# EasyEDA Pro project ProPrj_功率计集成分电板_2025-12-12.epro

# Schematic Schematic1
Board Name: Board1; Create Date: 2025-11-25; Page Name: P1; Project Name: 功率计集成分电板; Schematic Name: Schematic1; Update Date: 2025-12-05; Company: 嘉立创EDA; Page Size: A4; Version: V1.0
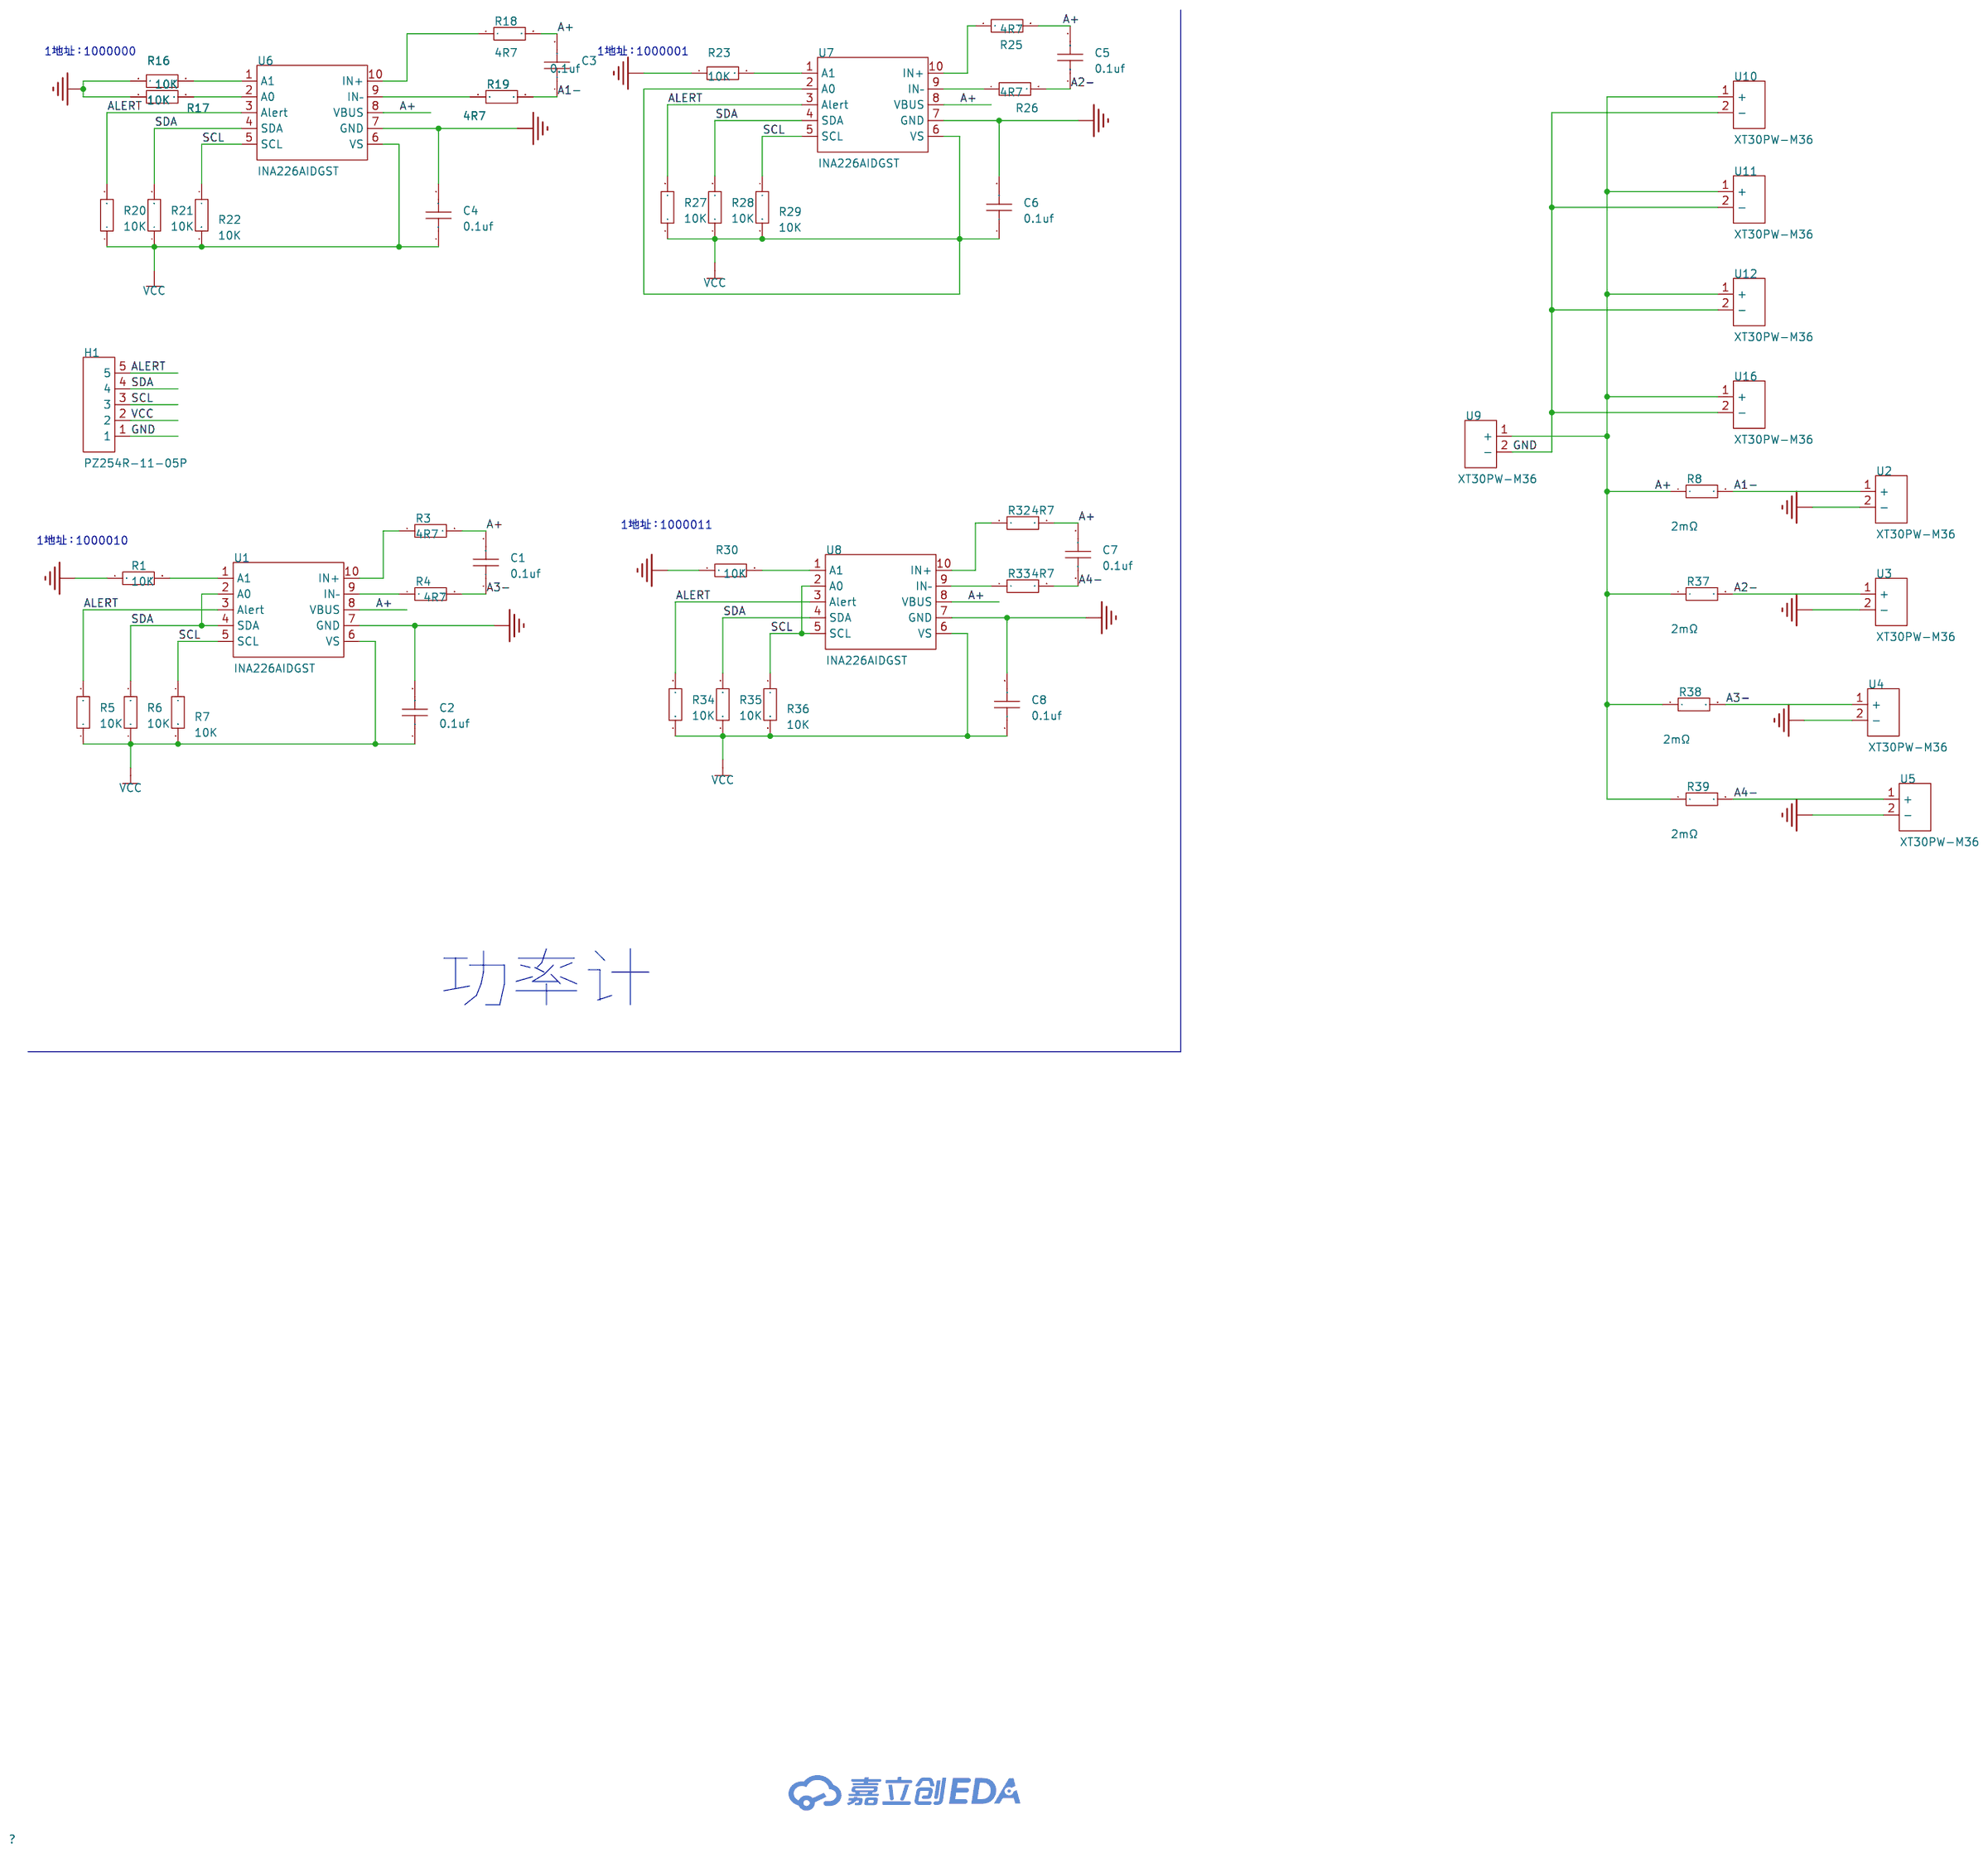
[diagram p0: schematic sheet]

## Parts
C1  0.1uf  [C0603]
C2  0.1uf  [C0603]
C3  0.1uf  [C0603]
C4  0.1uf  [C0603]
C5  0.1uf  [C0603]
C6  0.1uf  [C0603]
C7  0.1uf  [C0603]
C8  0.1uf  [C0603]
H1  PZ254R-11-05P  [HDR-TH_5P-P2.54-H-M-W10.4]
R1  10K  [R0603]
R3  4R7  [R0603]
R4  4R7  [R0603]
R5  10K  [R0603]
R6  10K  [R0603]
R7  10K  [R0603]
R8  2mΩ  [R0603]
R16  10K  [R0603]
R17  10K  [R0603]
R18  4R7  [R0603]
R19  4R7  [R0603]
R20  10K  [R0603]
R21  10K  [R0603]
R22  10K  [R0603]
R23  10K  [R0603]
R25  4R7  [R0603]
R26  4R7  [R0603]
R27  10K  [R0603]
R28  10K  [R0603]
R29  10K  [R0603]
R30  10K  [R0603]
R32  4R7  [R0603]
R33  4R7  [R0603]
R34  10K  [R0603]
R35  10K  [R0603]
R36  10K  [R0603]
R37  2mΩ  [R0603]
R38  2mΩ  [R0603]
R39  2mΩ  [R0603]
U1  INA226AIDGST  [VSSOP-10_L3.0-W3.0-P0.50-LS4.9-BL]
U2  XT30PW-M36  [CONN-TH_2P-P5.00_XT30PW-M36]
U3  XT30PW-M36  [CONN-TH_2P-P5.00_XT30PW-M36]
U4  XT30PW-M36  [CONN-TH_2P-P5.00_XT30PW-M36]
U5  XT30PW-M36  [CONN-TH_2P-P5.00_XT30PW-M36]
U6  INA226AIDGST  [VSSOP-10_L3.0-W3.0-P0.50-LS4.9-BL]
U7  INA226AIDGST  [VSSOP-10_L3.0-W3.0-P0.50-LS4.9-BL]
U8  INA226AIDGST  [VSSOP-10_L3.0-W3.0-P0.50-LS4.9-BL]
U9  XT30PW-M36  [CONN-TH_2P-P5.00_XT30PW-M36]
U10  XT30PW-M36  [CONN-TH_2P-P5.00_XT30PW-M36]
U11  XT30PW-M36  [CONN-TH_2P-P5.00_XT30PW-M36]
U12  XT30PW-M36  [CONN-TH_2P-P5.00_XT30PW-M36]
U16  XT30PW-M36  [CONN-TH_2P-P5.00_XT30PW-M36]

## Library data of the parts
C1-C8 = CAP_0603: Supplier Footprint: 0603
H1 = PZ254R-11-05P: 插针结构:1x5P;间距:2.54mm;行距:-;圆针/方针:方针;安装方式:弯插;排数:单排;总PIN位数:5P;额定电流:-;额定电压:-;配合针长度:6mm;塑高:2.5mm;触头材质:黄铜;触头镀层:-;工作温度:-40℃~+105℃;颜色:黑色;; LCSC Part Name: 1x5P 间距:2.54mm 方针 弯插; Supplier Part: C492413; Manufacturer: XFCN(兴飞); Supplier Footprint: 弯插,P=2.54mm; JLCPCB Part Class: 扩展库; Datasheet: https://atta.szlcsc.com/upload/public/pdf/source/20200309/C492413_82088D06BDD816AEC12FB986624DD327.pdf; Supplier: LCSC; Pin Structure: 1x5P; Pitch: 2.54mm; Circluar Pins/Square Pins: 方针; Mounting Type: 弯插; Number of Rows: 单排; Number of Pins: 5P; Length of Mating Pin: 6mm; Insulation Height: 2.5mm; Contact Material: 黄铜; Operating Temperature: -40℃~+105℃; Color: 黑色
R1 R3-R7 R16-R23 R25-R30 R32-R36 = Res_0603: Supplier Footprint: 0603
R8 R37-R39 = WFCP06032L000FE66: 电阻类型:-;阻值:2mΩ;精度:±1%;功率:500mW;温度系数:±100ppm/℃;; LCSC Part Name: 2mΩ ±1% 500mW; Supplier Part: C4077045; Manufacturer: VISHAY(威世); Supplier Footprint: 0603; JLCPCB Part Class: Extended Part; Datasheet: https://atta.szlcsc.com/upload/public/pdf/source/20231212/95FD194A86FE0177FC1AB75510CE32D6.pdf; Supplier: LCSC; Tolerance: ±1%; Power(Watts): 500mW; Temperature Coefficient: ±100ppm/℃; Operating Temperature Range: -55℃~+170℃
U1 U6-U8 = INA226AIDGST: 共模电压:36V;; LCSC Part Name: 高侧/低侧双向电流/功率监视器; Supplier Part: C2653870; Manufacturer: TI(德州仪器); Supplier Footprint: VSSOP-10-0.5mm; JLCPCB Part Class: 扩展库; Datasheet: https://www.ti.com/cn/lit/gpn/ina226; Supplier: LCSC; Vcm - Common Mode Voltage: 36V; Operating Temperature: -40℃~+125℃
U2-U5 U9-U12 U16 = XT30PW-M36: Supplier Part: C9900222726; Supplier Footprint: XT30; Supplier: LCSC

## Nets
GND: C2.2 C4.2 C6.2 C8.2 H1.1 R1.1 R16.1 R17.1 R23.1 R30.1 U1.7(GND) U2.2(-) U3.2(-) U4.2(-) U5.2(-) U6.7(GND) U7.7(GND) U8.7(GND) U9.2(-) U10.2(-) U11.2(-) U12.2(-) U16.2(-)
VCC: C2.1 C4.1 C6.1 C8.1 H1.2 R5.1 R6.1 R7.2 R20.1 R21.1 R22.2 R27.1 R28.1 R29.2 R34.1 R35.1 R36.2 U1.6(VS) U6.6(VS) U7.2(A0) U7.6(VS) U8.6(VS)
A1-: C3.1 R8.2 R19.2 U2.1(+)
A2-: C5.1 R26.2 R37.2 U3.1(+)
A3-: C1.1 R4.2 R38.2 U4.1(+)
A4-: C7.1 R33.2 R39.2 U5.1(+)
A+: C1.2 C3.2 C5.2 C7.2 R3.2 R8.1 R18.2 R25.2 R32.2 R37.1 R38.1 R39.1 U1.8(VBUS) U6.8(VBUS) U7.8(VBUS) U8.8(VBUS) U9.1(+) U10.1(+) U11.1(+) U12.1(+) U16.1(+)
ALERT: H1.5 R5.2 R20.2 R27.2 R34.2 U1.3(Alert) U6.3(Alert) U7.3(Alert) U8.3(Alert)
SCL: H1.3 R7.1 R22.1 R29.1 R36.1 U1.5(SCL) U6.5(SCL) U7.5(SCL) U8.2(A0) U8.5(SCL)
SDA: H1.4 R6.2 R21.2 R28.2 R35.2 U1.2(A0) U1.4(SDA) U6.4(SDA) U7.4(SDA) U8.4(SDA)
$1N353: R4.1 U1.9(IN–)
$1N378: R3.1 U1.10(IN+)
$1N388: R1.2 U1.1(A1)
$1N1566: R16.2 U6.1(A1)
$1N1568: R17.2 U6.2(A0)
$1N1909: R26.1 U7.9(IN–)
$1N1914: R25.1 U7.10(IN+)
$1N1921: R23.2 U7.1(A1)
$1N2264: R33.1 U8.9(IN–)
$1N2269: R32.1 U8.10(IN+)
$1N2276: R30.2 U8.1(A1)
$1N4532: R19.1 U6.9(IN–)
$1N4545: R18.1 U6.10(IN+)

## Notes on the sheet
- 1地址：1000000
- 1地址：1000001
- 1地址：1000011
- 1地址：1000010
- 功率计

# Schematic Schematic2
Board Name: Board2; Create Date: 2025-12-06; Page Name: P1; Project Name: 功率计集成分电板; Schematic Name: Schematic2; Update Date: 2025-12-08; Company: 嘉立创EDA; Page Size: A4; Version: V1.0
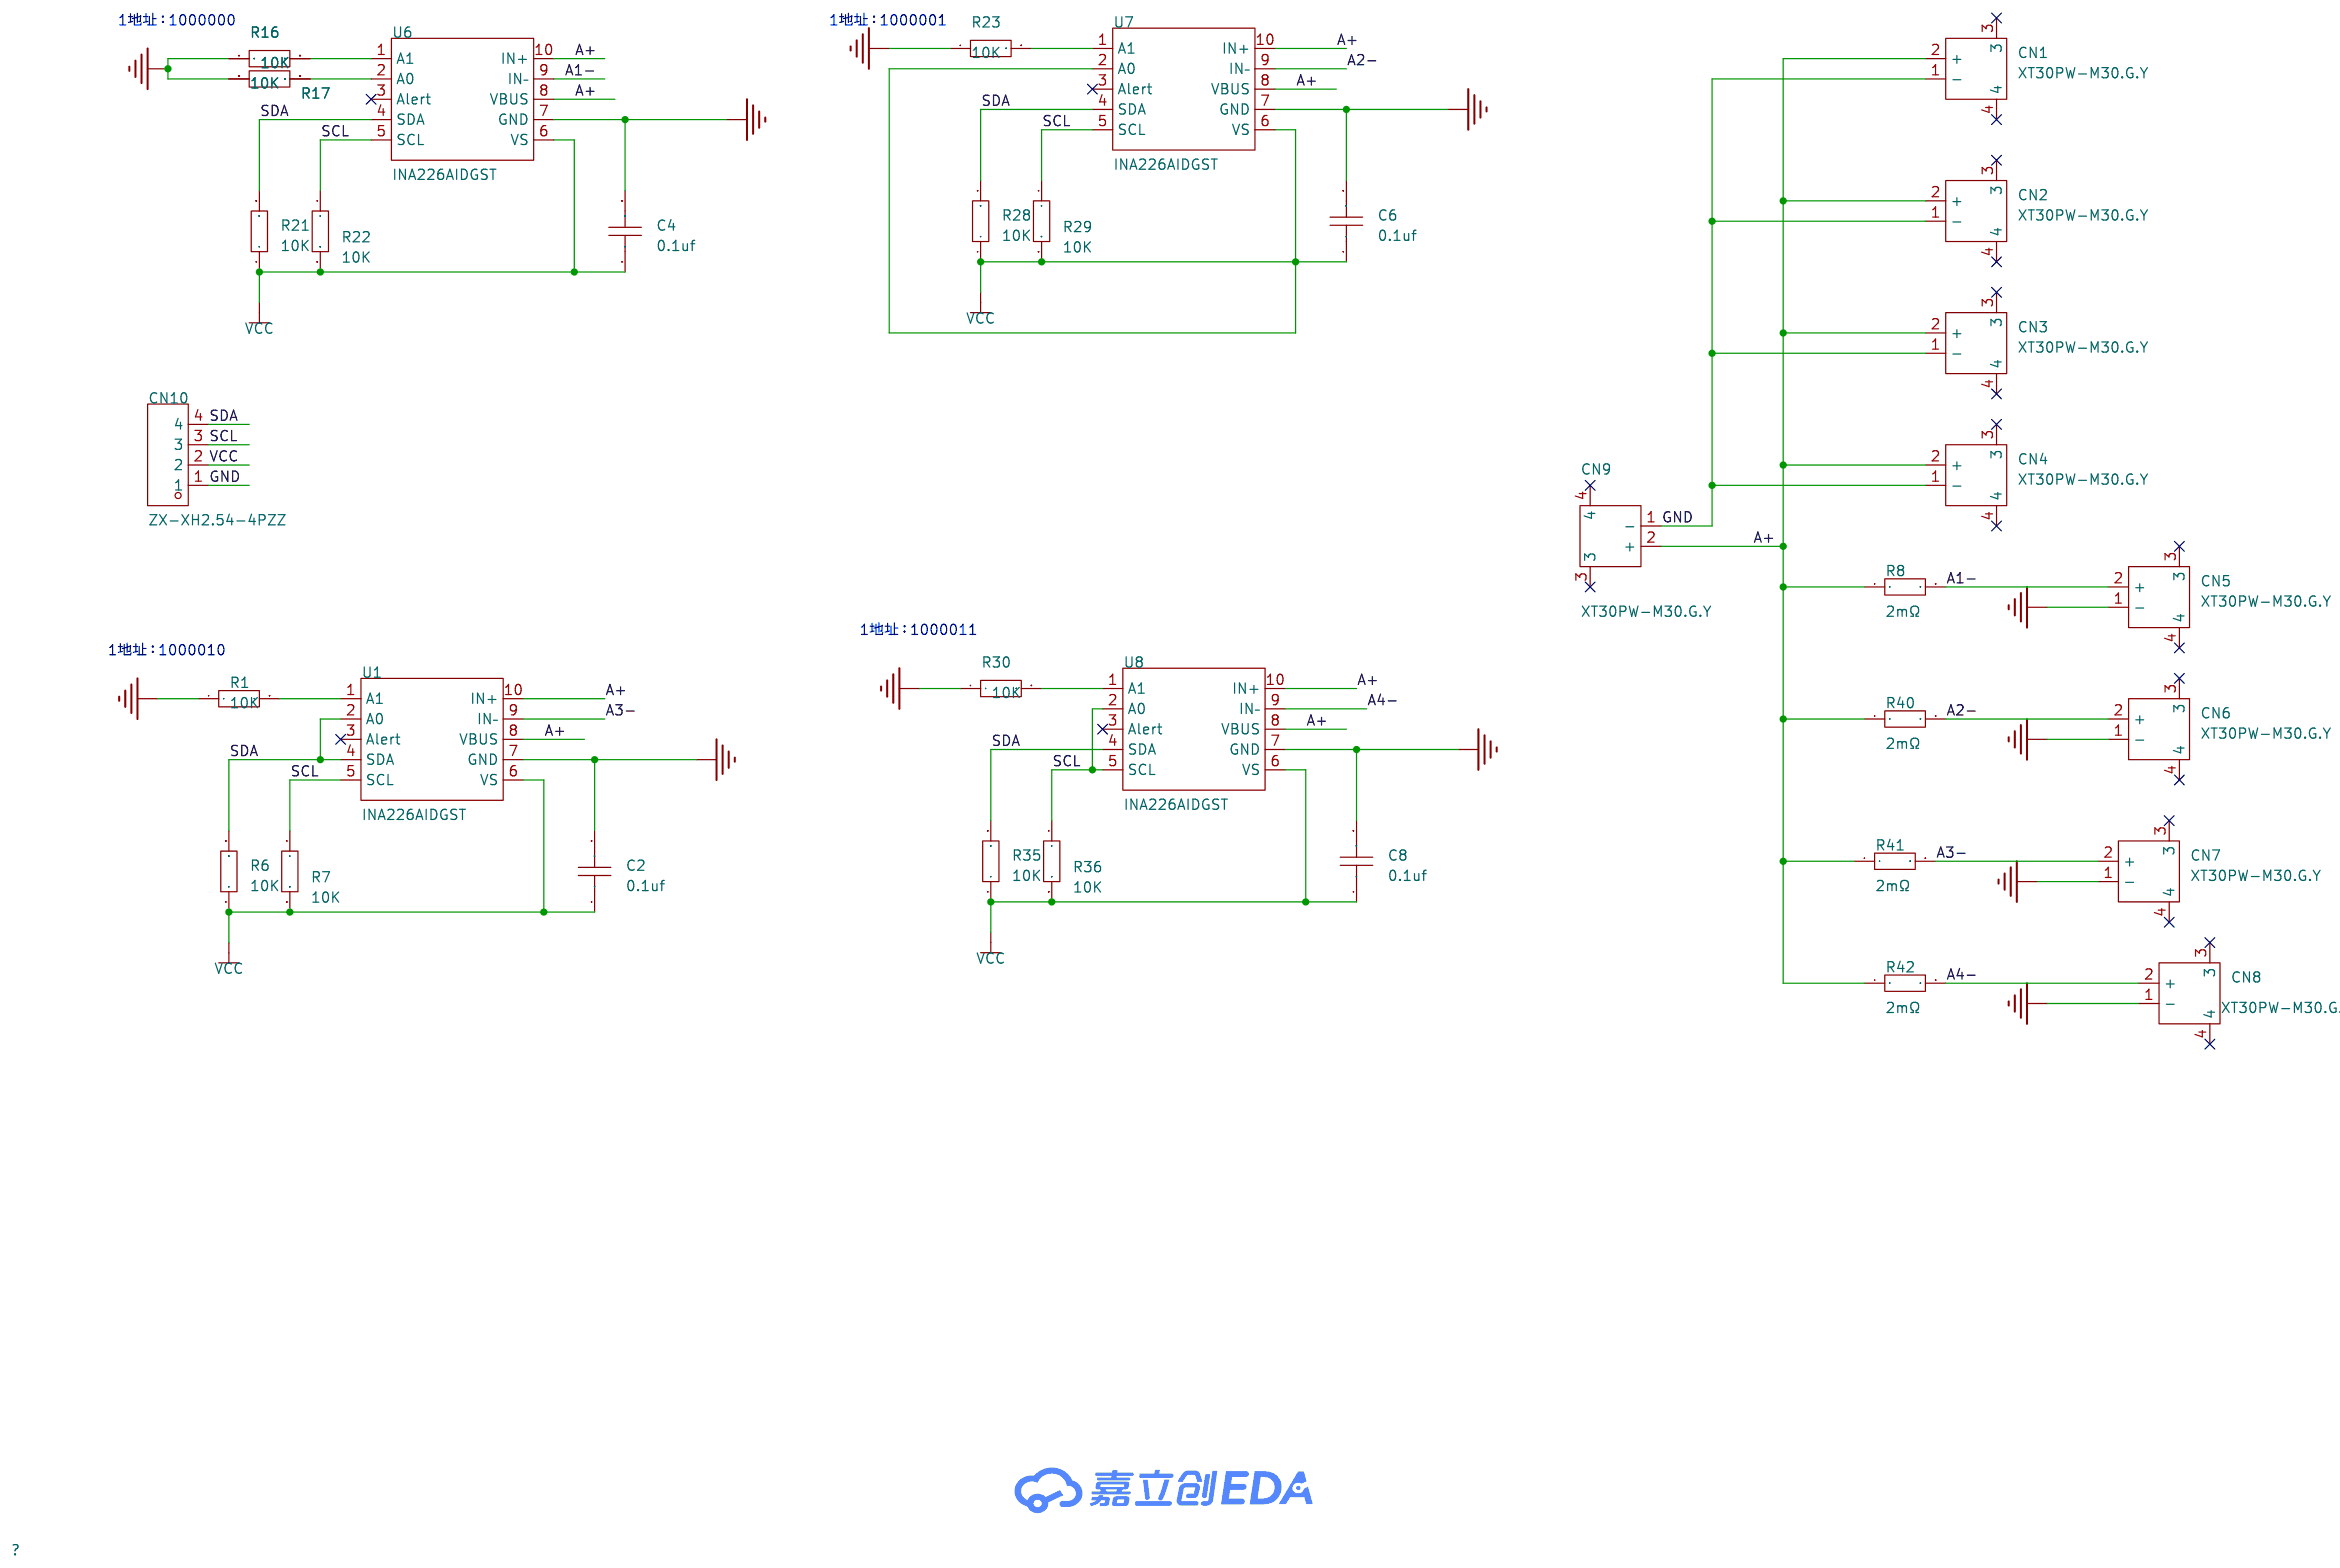
[diagram p1: schematic sheet]

## Parts
C2  0.1uf  [C0603]
C4  0.1uf  [C0603]
C6  0.1uf  [C0603]
C8  0.1uf  [C0603]
CN1  XT30PW-M30.G.Y  [CONN-TH_XT30PW-M]
CN2  XT30PW-M30.G.Y  [CONN-TH_XT30PW-M]
CN3  XT30PW-M30.G.Y  [CONN-TH_XT30PW-M]
CN4  XT30PW-M30.G.Y  [CONN-TH_XT30PW-M]
CN5  XT30PW-M30.G.Y  [CONN-TH_XT30PW-M]
CN6  XT30PW-M30.G.Y  [CONN-TH_XT30PW-M]
CN7  XT30PW-M30.G.Y  [CONN-TH_XT30PW-M]
CN8  XT30PW-M30.G.Y  [CONN-TH_XT30PW-M]
CN9  XT30PW-M30.G.Y  [CONN-TH_XT30PW-M]
CN10  ZX-XH2.54-4PZZ  [CONN-TH_4P-P2.50_4PIN]
R1  10K  [R0603]
R6  10K  [R0603]
R7  10K  [R0603]
R8  2mΩ  [RES-SMD_L6.4-W3.2-A]
R16  10K  [R0603]
R17  10K  [R0603]
R21  10K  [R0603]
R22  10K  [R0603]
R23  10K  [R0603]
R28  10K  [R0603]
R29  10K  [R0603]
R30  10K  [R0603]
R35  10K  [R0603]
R36  10K  [R0603]
R40  2mΩ  [RES-SMD_L6.4-W3.2-A]
R41  2mΩ  [RES-SMD_L6.4-W3.2-A]
R42  2mΩ  [RES-SMD_L6.4-W3.2-A]
U1  INA226AIDGST  [VSSOP-10_L3.0-W3.0-P0.50-LS4.9-BL]
U6  INA226AIDGST  [VSSOP-10_L3.0-W3.0-P0.50-LS4.9-BL]
U7  INA226AIDGST  [VSSOP-10_L3.0-W3.0-P0.50-LS4.9-BL]
U8  INA226AIDGST  [VSSOP-10_L3.0-W3.0-P0.50-LS4.9-BL]

## Library data of the parts
C2 C4 C6 C8 = CAP_0603: Supplier Footprint: 0603
CN1-CN9 = XT30PW-M30.G.Y: 类别:-;类型1:-;; LCSC Part Name: AMASS(艾迈斯)航模插头 卧式弯脚 XT30PW-M公头; Supplier Part: C431092; Manufacturer: AMASS(艾迈斯); JLCPCB Part Class: 扩展库; Datasheet: https://item.szlcsc.com/datasheet/XT30PW-M30.G.Y/426930.html; Supplier: LCSC; Type: 航模插头; RatedVoltage: DC 500V; InterfaceType: 公头; RatedCurrent: 15A; RecommendedWireGauge: 16/18/20AWG; contact resistance: 1.2mΩ; specifications: 2pin
CN10 = ZX-XH2.54-4PZZ: 插针结构:1x4P;间距:2.5mm;安装方式:直插;参考系列:XH;总PIN数:4P;排数:1;每排PIN数:4;行距:-;额定电流:3A;触头材质:黄铜;触头镀层:锡;工作温度:-25℃~+85℃;; LCSC Part Name: 1x4P 间距:2.5mm 直插 系列:XH; Supplier Part: C7429634; Manufacturer: Megastar(兆星); Supplier Footprint: 插件,P=2.5mm; JLCPCB Part Class: 扩展库; Datasheet: https://item.szlcsc.com/datasheet/ZX-XH2.54-4PZZ/8427551.html; Supplier: LCSC; Pins Structure: 1x4P; Pitch: 2.5mm; Mounting Type: 直插; Reference Series: XH; Number of Pins: 4P; Number of Rows: 1; Number of PINs Per Row: 4; Current Rating: 3A; Contact Material: 黄铜; Contact Plating: 锡; Operating Temperature: -25℃~+85℃; Voltage Rating: 250V; Plastic Material: PA66; Flame Retardant Rating: UL94V-0; Color: 白色; Z-Height of the Board: 7mm; X-Length of Bottom Edge on Board (Spacing Line): 12.5mm; Y-Width of Bottom Edge on Board: 5.9mm
R1 R6 R7 R16 R17 R21-R23 R28-R30 R35 R36 = Res_0603: Supplier Footprint: 0603
R8 R40-R42 = JER2512F3R002L: 电阻类型:采样电阻；合金电阻;阻值:2mΩ;精度:±1%;功率:3W;温度系数:±50ppm/℃;; LCSC Part Name: 2mΩ 3W 2512 ±1%; Supplier Part: C46634456; Manufacturer: JIERR(捷而瑞); Supplier Footprint: 2512; JLCPCB Part Class: Extended Part; Datasheet: https://item.szlcsc.com/datasheet/JER2512F3R002L/48788258.html; Supplier: LCSC; Type: 采样电阻；合金电阻; Tolerance: ±1%; Power(Watts): 3W; Temperature Coefficient: ±50ppm/℃
U1 U6-U8 = INA226AIDGST: 共模电压:36V;; LCSC Part Name: 高侧/低侧双向电流/功率监视器; Supplier Part: C2653870; Manufacturer: TI(德州仪器); Supplier Footprint: VSSOP-10-0.5mm; JLCPCB Part Class: 扩展库; Datasheet: https://www.ti.com/cn/lit/gpn/ina226; Supplier: LCSC; Vcm - Common Mode Voltage: 36V; Operating Temperature: -40℃~+125℃

## Nets
GND: C2.2 C4.2 C6.2 C8.2 CN1.1(-) CN2.1(-) CN3.1(-) CN4.1(-) CN5.1(-) CN6.1(-) CN7.1(-) CN8.1(-) CN9.1(-) CN10.1 R1.1 R16.1 R17.1 R23.1 R30.1 U1.7(GND) U6.7(GND) U7.7(GND) U8.7(GND)
VCC: C2.1 C4.1 C6.1 C8.1 CN10.2 R6.1 R7.2 R21.1 R22.2 R28.1 R29.2 R35.1 R36.2 U1.6(VS) U6.6(VS) U7.2(A0) U7.6(VS) U8.6(VS)
A1-: CN5.2(+) R8.2 U6.9(IN–)
A2-: CN6.2(+) R40.2 U7.9(IN–)
A3-: CN7.2(+) R41.2 U1.9(IN–)
A4-: CN8.2(+) R42.2 U8.9(IN–)
A+: CN1.2(+) CN2.2(+) CN3.2(+) CN4.2(+) CN9.2(+) R8.1 R40.1 R41.1 R42.1 U1.8(VBUS) U1.10(IN+) U6.8(VBUS) U6.10(IN+) U7.8(VBUS) U7.10(IN+) U8.8(VBUS) U8.10(IN+)
SCL: CN10.3 R7.1 R22.1 R29.1 R36.1 U1.5(SCL) U6.5(SCL) U7.5(SCL) U8.2(A0) U8.5(SCL)
SDA: CN10.4 R6.2 R21.2 R28.2 R35.2 U1.2(A0) U1.4(SDA) U6.4(SDA) U7.4(SDA) U8.4(SDA)
$1N1720: R1.2 U1.1(A1)
$1N1742: R16.2 U6.1(A1)
$1N1743: R17.2 U6.2(A0)
$1N1761: R23.2 U7.1(A1)
$1N1774: R30.2 U8.1(A1)

Not connected (* = marked no-connect by the designer): CN1 3* 4*; CN2 3* 4*; CN3 3* 4*; CN4 3* 4*; CN5 3* 4*; CN6 3* 4*; CN7 3* 4*; CN8 3* 4*; CN9 3* 4*; U1 3(Alert)*; U6 3(Alert)*; U7 3(Alert)*; U8 3(Alert)*

## Notes on the sheet
- 1地址：1000000
- 1地址：1000001
- 1地址：1000011
- 1地址：1000010

# Board PCB1
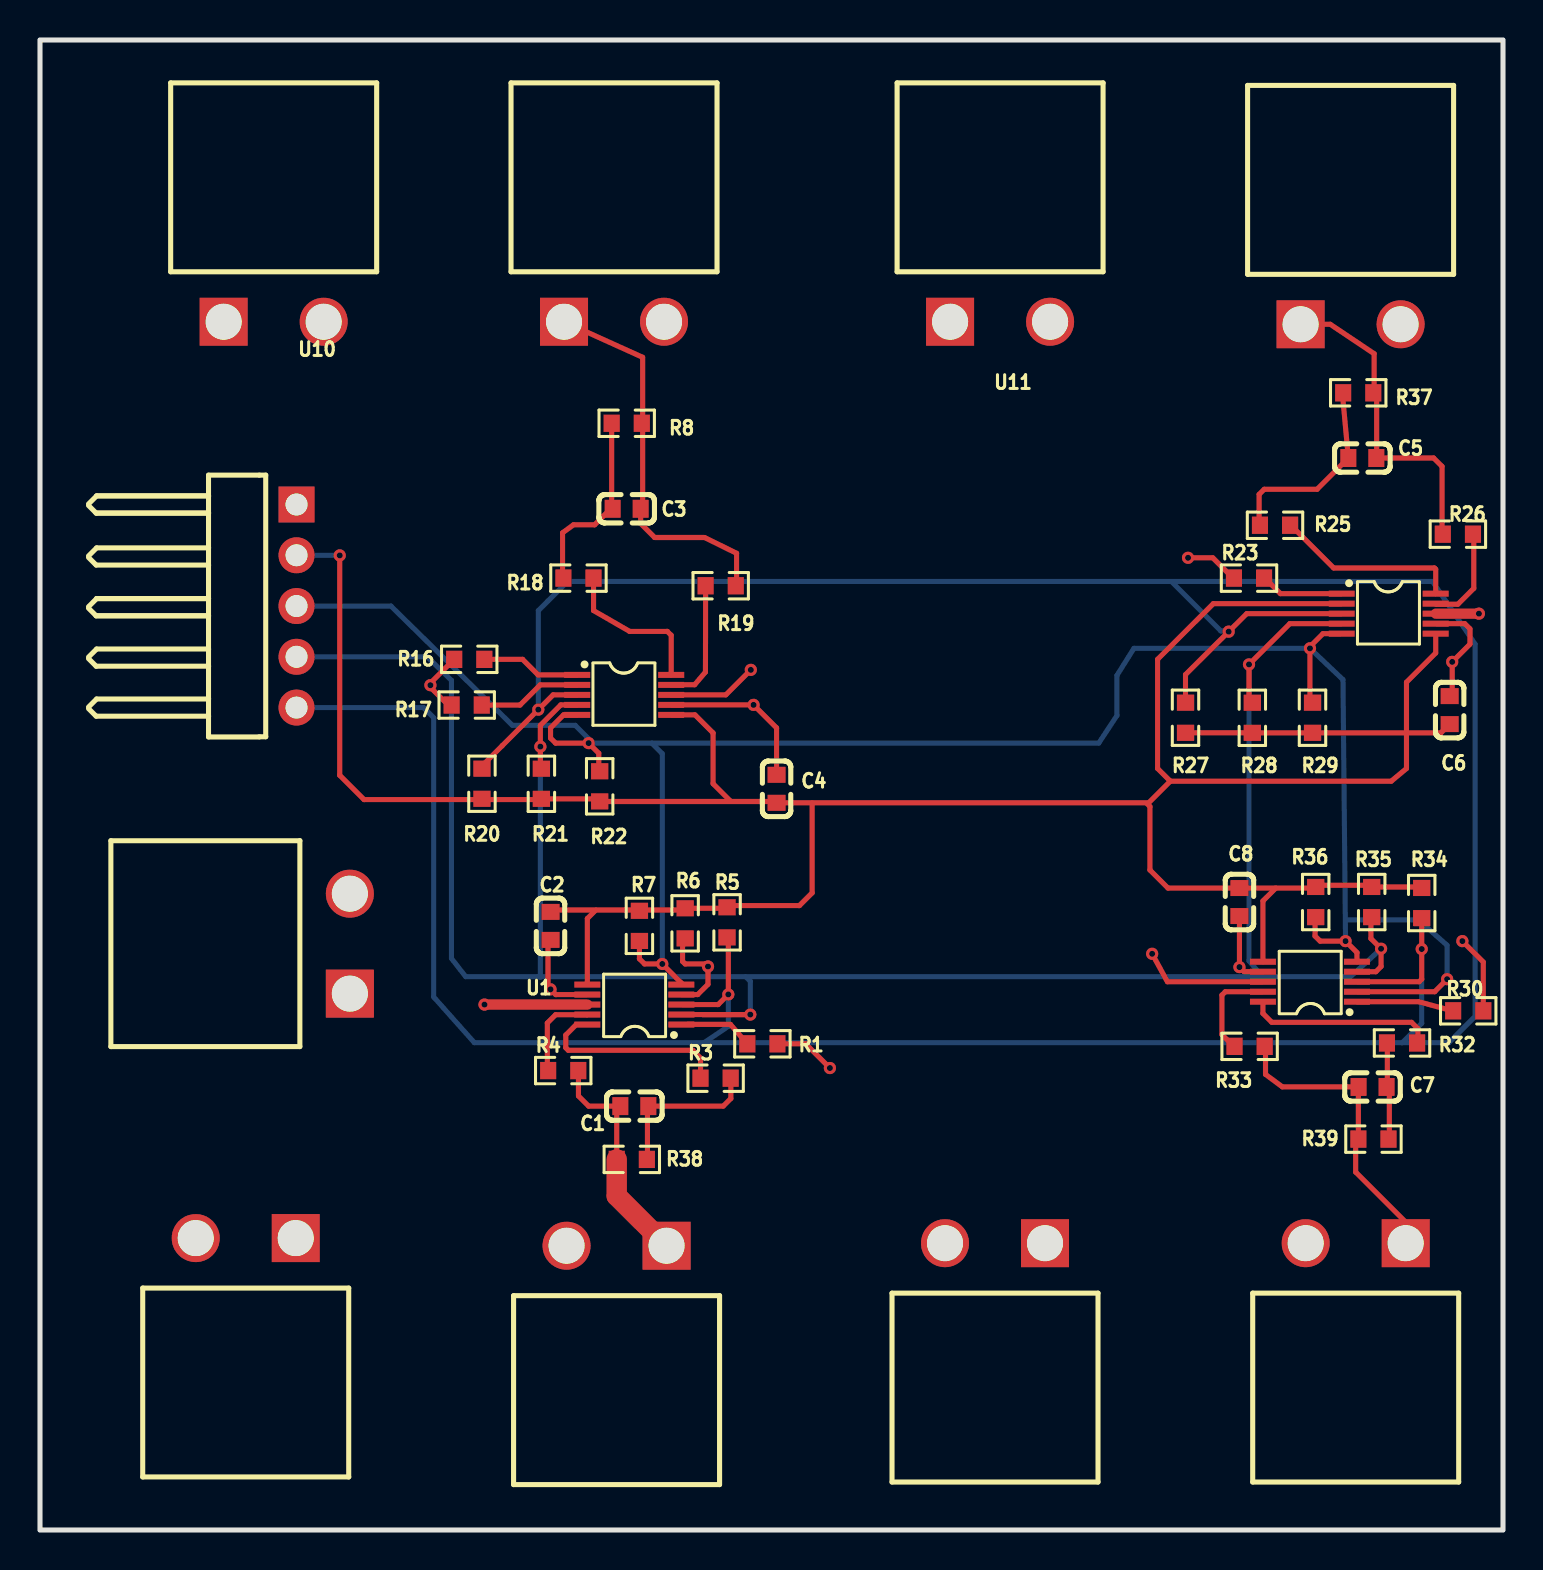
[diagram p2: board, top side]
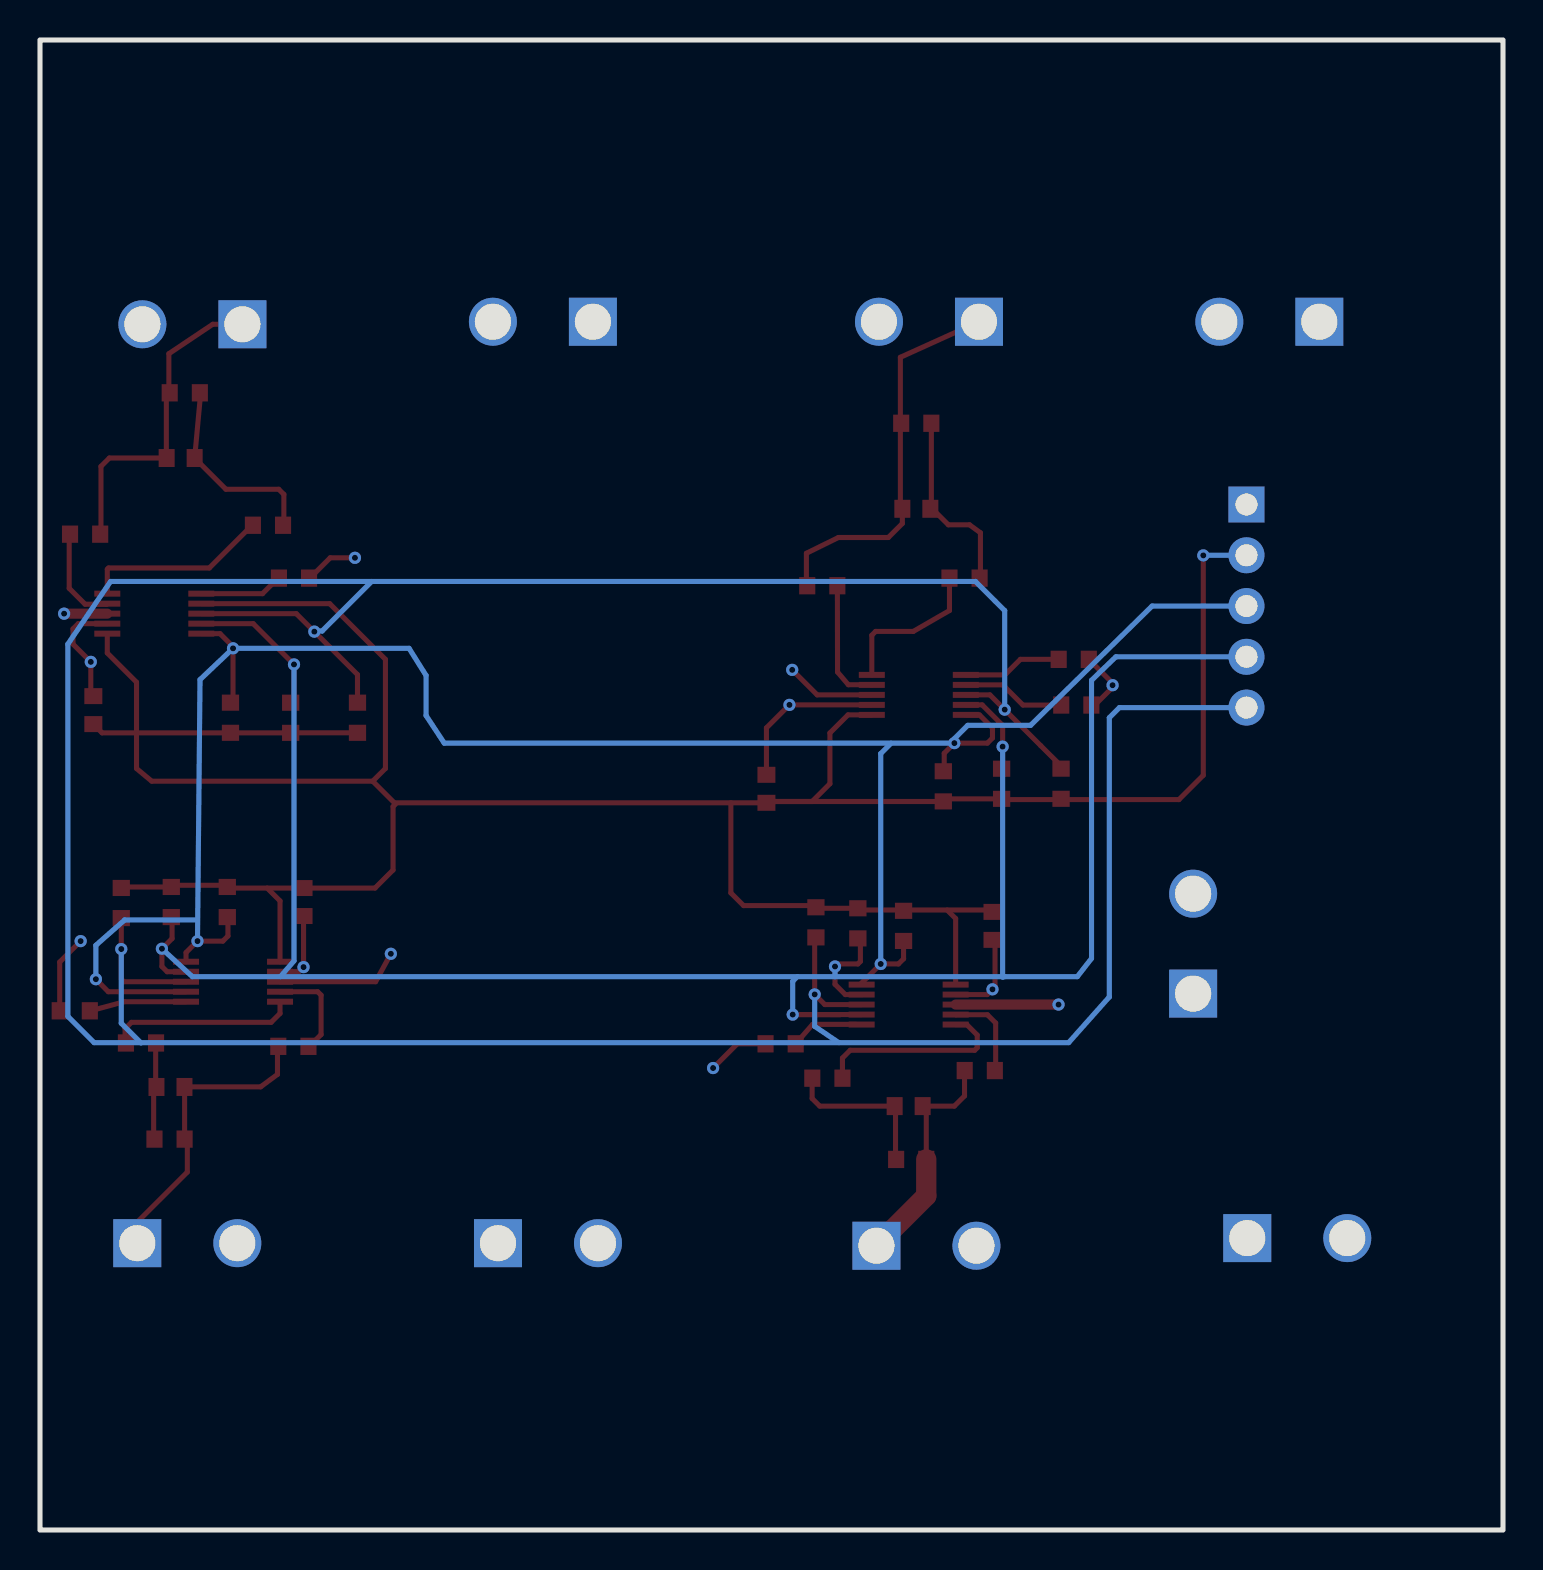
[diagram p3: board, bottom side, seen from below]

Outline 73.15 x 74.55 mm; copper layers: Top Layer, Inner1, Inner2, Bottom Layer. Coordinates in mm from the lower left corner of the outline.
Outline path: rectangle 0,74.55 73.15,0
Stack: Top Layer 0.035mm 外层铜厚1oz / Dielectric1 0.2104mm 7628 RC49% 8.6mil / Inner1 0.0152mm 内层铜厚 / Dielectric2 1.065mm 1.1mm H/HOZ Copper / Inner2 0.0152mm 内层铜厚 / 介电3 0.2104mm 7628 RC49% 8.6mil / Bottom Layer 0.035mm 外层铜厚1oz

## Design rules (mm)
template: JLCPCB Capability(Two Layers Board)
spacing copperThickness1oz (default): track to track 0.102, other pairs 0.152 to 0.3
spacing copperThickness2oz: track to track 0.203, other pairs 0.152 to 0.3
track width copperThickness1oz (default): min 0.127, default 0.254, max 2.54
track width copperThickness2oz: min 0.203, default 0.254, max 2.54
differential pair differentialPair (default): width min 0.127, default 0.254, max 2.54; gap min 0.152, default 0.152
via viaSize (default): diameter min 0.5, default 0.61, max 10; hole min 0.3, default 0.305, max 6.3

## Placement (name value [footprint] x y rotation side)
C1  0.1uf  [C0603]  29.72 21.21 0 top
C2  0.1uf  [C0603]  25.53 30.23 270 top
C3  0.1uf  [C0603]  29.33 51.09 180 top
C4  0.1uf  [C0603]  36.83 37.08 90 top
C5  0.1uf  [C0603]  66.12 53.63 180 top
C6  0.1uf  [C0603]  70.48 41.02 90 top
C7  0.1uf  [C0603]  66.63 22.17 0 top
C8  0.1uf  [C0603]  59.97 31.42 270 top
H1  PZ254R-11-05P  [HDR-TH_5P-P2.54-H-M-W10.4]  12.83 46.23 270 top
R1  10K  [R0603]  36.12 24.33 180 top
R3  4R7  [R0603]  33.78 22.61 0 top
R4  4R7  [R0603]  26.16 22.99 0 top
R5  10K  [R0603]  34.35 30.4 270 top
R6  10K  [R0603]  32.26 30.35 270 top
R7  10K  [R0603]  29.97 30.23 90 top
R8  2mΩ  [R0603]  29.34 55.37 0 top
R16  10K  [R0603]  21.46 43.56 0 top
R17  10K  [R0603]  21.34 41.27 0 top
R18  4R7  [R0603]  26.92 47.62 180 top
R19  4R7  [R0603]  34.04 47.24 0 top
R20  10K  [R0603]  22.1 37.34 90 top
R21  10K  [R0603]  25.07 37.34 90 top
R22  10K  [R0603]  27.98 37.21 270 top
R23  10K  [R0603]  60.45 47.62 0 top
R25  4R7  [R0603]  61.75 50.27 180 top
R26  4R7  [R0603]  70.9 49.82 180 top
R27  10K  [R0603]  57.28 40.64 90 top
R28  10K  [R0603]  60.62 40.64 90 top
R29  10K  [R0603]  63.63 40.64 270 top
R30  10K  [R0603]  71.41 25.98 180 top
R32  4R7  [R0603]  68.1 24.37 180 top
R33  4R7  [R0603]  60.48 24.2 0 top
R34  10K  [R0603]  69.09 31.37 270 top
R35  10K  [R0603]  66.59 31.42 270 top
R36  10K  [R0603]  63.79 31.42 90 top
R37  2mΩ  [R0603]  65.91 56.9 0 top
R38  2mΩ  [R0603]  29.59 18.54 180 top
R39  2mΩ  [R0603]  66.67 19.56 180 top
U1  INA226AIDGST  [VSSOP-10_L3.0-W3.0-P0.50-LS4.9-BL]  29.72 26.29 90 top
U2  XT30PW-M36  [CONN-TH_2P-P5.00_XT30PW-M36]  28.7 60.45 180 top
U3  XT30PW-M36  [CONN-TH_2P-P5.00_XT30PW-M36]  65.53 60.33 180 top
U4  XT30PW-M36  [CONN-TH_2P-P5.00_XT30PW-M36]  28.83 14.22 0 top
U5  XT30PW-M36  [CONN-TH_2P-P5.00_XT30PW-M36]  65.79 14.35 0 top
U6  INA226AIDGST  [VSSOP-10_L3.0-W3.0-P0.50-LS4.9-BL]  29.21 41.78 270 top
U7  INA226AIDGST  [VSSOP-10_L3.0-W3.0-P0.50-LS4.9-BL]  67.44 45.85 270 top
U8  INA226AIDGST  [VSSOP-10_L3.0-W3.0-P0.50-LS4.9-BL]  63.5 27.43 90 top
U9  XT30PW-M36  [CONN-TH_2P-P5.00_XT30PW-M36]  15.49 29.34 270 top
U10  XT30PW-M36  [CONN-TH_2P-P5.00_XT30PW-M36]  11.68 60.45 180 top
U11  XT30PW-M36  [CONN-TH_2P-P5.00_XT30PW-M36]  48.01 60.45 180 top
U12  XT30PW-M36  [CONN-TH_2P-P5.00_XT30PW-M36]  47.75 14.35 0 top
U16  XT30PW-M36  [CONN-TH_2P-P5.00_XT30PW-M36]  10.29 14.61 0 top

## Footprints (pads in the part's own frame, mm; a bottom-side part is the same pattern mirrored in y, then rotated)
C0603
  rect 0.8x0.9 smd: 1(-0.7,0) 2(0.7,0)
CONN-TH_2P-P5.00_XT30PW-M36
  rect 2.4x2.4 hole 1.8: 1(2.5,0)
  round 2.4 hole 1.8: 2(-2.5,0)
HDR-TH_5P-P2.54-H-M-W10.4
  rect 1.8x1.8 hole 1.1: 1(-5.08,0)
  round 1.8 hole 1.1: 2(-2.54,0) 3(0,0) 4(2.54,0) 5(5.08,0)
R0603
  rect 0.806x0.864 smd: 1(-0.753,0) 2(0.753,0)
VSSOP-10_L3.0-W3.0-P0.50-LS4.9-BL
  rect 0.3x1.3 smd: 1(-1,-2.35) 2(-0.5,-2.35) 3(0,-2.35) 4(0.5,-2.35) 5(1,-2.35) 6(1,2.35) 7(0.5,2.35) 8(0,2.35) 9(-0.5,2.35) 10(-1,2.35)

## Nets
As in the schematic.

## Via types
v1: diameter 0.61, hole 0.305, Top Layer to Bottom Layer, 27 vias

## Routing (per net, layer and track width the routed paths; a pad name or vN(x,y) marks a point on that pad's centre or on a via; arc(x,y) is an arc through that point)
GND: length 34.9
  Top Layer w0.254: 20.57,41.27 20.41,41.27 19.52,42.16 19.52,42.37 R16.1 ; C2.2 25.4,29.4 25.4,27.18 25.79,26.79 U1.7 ; U6.7 v1(35.68,41.28) 36.83,40.13 36.83,37.78 ; 36.83,24.33 38.28,24.33 v1(39.5,23.11) ; v1(57.4,48.64) 58.64,48.64 59.66,47.62 ; C8.2 v1(59.97,28.16) 60.2,27.94 61.14,27.94 U8.7 ; 69.79,45.35 71.24,45.35 71.5,45.08 71.5,44.32 v1(70.61,43.43) 70.61,41.85 C6.2 ; v1(71.12,29.46) 72.17,28.42 72.17,26.23
  vias: v1(19.52,42.27) v1(25.53,27.05)
VCC: length 157
  Top Layer w0.254: v1(14.99,48.76) 14.99,37.76 16.2,36.54 25.03,36.54 R21.1 27.93,36.58 28.07,36.45 36.76,36.45 ; C2.1 25.62,31.02 32.17,31.02 R6.1 34.28,31.11 34.42,31.24 ; 27.8,31.02 27.37,30.59 U1.6 ; 36.76,36.45 34.54,36.45 33.66,37.34 33.66,39.88 32.75,40.78 U6.6 ; 36.76,36.45 C4.1 55.43,36.38 56.51,37.47 ; 34.35,31.24 37.97,31.24 38.61,31.88 38.61,36.38 ; 55.37,36.32 55.5,36.19 55.5,33.02 56.4,32.12 C8.1 63.62,32.12 63.75,32.26 66.5,32.26 R35.1 69.09,32.17 ; 56.51,37.47 55.88,38.1 55.88,43.56 58.67,46.35 U7.2 ; 56.51,37.47 67.56,37.47 68.33,38.1 68.33,42.42 69.79,43.88 69.79,44.85 ; R27.1 60.62,39.89 R28.1 70.05,39.88 C6.1 ; 61.79,32.12 61.15,31.47 U8.6
  Bottom Layer w0.254: H1.2 14.99,48.77
A+: length 283.3
  Top Layer w0.254: 26.13,47.62 26.13,49.89 26.67,50.29 27.73,50.29 28.58,51.14 ; R8.1 28.58,51.14 ; 28.58,51.14 C3.2 ; 30.48,21.08 30.37,20.98 30.37,18.6 ; C1.2 34.16,21.21 34.54,21.59 34.54,22.61 ; U6.8 34.29,41.78 35.56,43.06 ; v1(55.61,28.83) 56.37,27.43 U8.8 ; 60.96,50.27 60.96,51.81 61.21,52.07 63.86,52.07 C5.2 65.12,56.89 ; 67.37,24.37 67.37,22.21 C7.2 67.47,22.02 67.47,19.56
  Top Layer w0.508: U1.8 v1(22.22,26.29) ; 69.79,45.85 v1(71.95,45.85)
  Inner2 w0.254: 28.57,57.4 28.54,57.37 28.54,55.37 ; 30.39,18.54 30.39,17.31
  Inner2 w0.508: 22.17,17.31 20.7,18.78 20.7,24.77 v1(22.22,26.29) ; 37.72,45.21 v1(35.54,43.03) 37.72,45.21 ; 37.72,45.21 37.72,57.4 37.59,57.53 ; 46.36,17.31 45.09,18.68 45.09,25.27 47.24,27.43 54.85,27.43 v1(55.61,28.83) ; 63.63,56.89 63.63,47.37 65.15,45.85 v1(71.95,45.85)
  Inner2 w1.27: U10.1 9.14,60.41 9.14,58.8 9.91,58.04 17.4,58.04 18.03,57.4 ; 15.49,17.31 U9.1 18.03,29.38 18.03,57.4 ; 15.49,17.31 12.79,14.61 ; 15.49,17.31 47.29,17.31 U12.1 ; 18.03,57.4 44.58,57.4 ; 44.58,57.4 45.47,58.29 45.47,60.41 U11.1 ; 44.58,57.4 45.09,56.89 65.12,56.89 ; 50.29,14.39 52.83,16.93 66.1,16.93 67.47,18.3 67.47,18.38
ALERT: length 187.9
  Top Layer w0.254: 22.1,38.13 22.1,38.23 25.65,41.78 U6.3 ; U1.3 33.91,26.29 v1(34.42,26.8) 34.42,29.61 ; 57.28,41.44 57.28,42.8 60.34,45.85 U7.3 ; U8.3 68.96,27.43 69.09,27.56 69.09,30.57
  Bottom Layer w0.254: H1.5 19.18,41.15 19.69,40.64 19.69,26.67 21.72,24.38 70.44,24.38 71.76,25.7 71.76,44.32 69.62,47.46 26.38,47.46 24.92,46 v1(24.92,41.05) ; 33.21,24.38 34.42,25.2 v1(34.42,26.8) ; 56.57,47.46 59.05,44.98 59.47,44.98 ; v1(69.09,29.07) 69.09,25.35 68.1,24.37
  vias: v1(59.44,44.95)
SCL: length 113.7
  Top Layer w0.254: U6.5 26.18,40.78 25.53,40.13 25.53,39.62 25.78,39.37 v1(27.43,39.37) 27.94,38.86 27.94,38.1 28.07,37.97 ; R7.1 29.97,28.58 30.23,28.32 v1(31.12,28.32) 32.07,27.37 U1.5 ; 63.63,41.4 63.5,41.53 63.5,44.2 64.15,44.85 U7.5 ; 63.75,30.62 63.75,29.72 64.01,29.46 v1(65.28,29.46) 65.85,28.89 U8.5 ; U8.2 69.74,26.93 v1(70.36,27.56)
  Bottom Layer w0.254: H1.3 17.55,46.23 23.62,40.26 26.76,40.26 27.43,39.59 v1(27.43,39.37) 52.94,39.37 53.85,40.75 53.85,42.76 54.7,44.11 v1(63.5,44.11) ; 30.59,39.37 31.12,38.84 v1(31.12,28.32) ; v1(63.5,44.11) 63.5,44.2 ; v1(63.5,44.11) 65.15,42.55 v1(65.28,29.46) ; 65.32,30.52 68.92,30.52 70.36,29.25 v1(70.36,27.56)
SDA: length 126.2
  Top Layer w0.254: 25.02,38.13 25.02,40.26 26.04,41.28 U6.4 ; U1.4 32.88,26.79 33.4,27.3 v1(33.4,28.19) 33.27,28.32 32.26,28.32 32.13,28.45 32.13,29.34 32.26,29.46 ; U1.2 v1(35.52,25.79) 33.15,25.78 ; R28.2 60.45,41.56 v1(60.45,43.31) 62.49,45.35 U7.4 ; U8.4 66.79,27.93 67.06,28.19 v1(67.06,29.08) 66.55,29.59 66.55,30.62
  Bottom Layer w0.254: H1.4 19.36,43.69 20.57,42.51 20.57,28.6 21.28,27.69 65.53,27.69 v1(67.06,29.08) ; v1(25.02,39.19) 25.02,27.66 24.89,27.69 ; v1(33.4,28.19) 33.4,27.68 ; 35.29,27.69 35.52,27.46 v1(35.52,25.79) ; v1(60.45,43.31) 60.45,28.47 61.13,27.69
A1-: length 19.6
  Top Layer w0.254: U2.1 30.13,58.67 30.13,51.19 C3.1 30.03,50.36 30.73,49.66 33.23,49.66 34.83,48.87 34.83,47.24
A2-: length 16.2
  Top Layer w0.254: U3.1 64.51,60.33 66.71,58.85 66.71,56.94 R37.2 ; 66.84,56.9 66.84,53.9 C5.1 69.68,53.63 70.1,53.21 70.1,49.82
A3-: length 11.7
  Top Layer w0.254: R4.2 26.92,22.98 26.92,21.72 27.43,21.21 C1.1 28.84,21.03 R38.2
  Top Layer w1.016: R38.2 28.84,16.72 U4.1
A4-: length 15.2
  Top Layer w0.254: 61.28,24.2 61.28,22.8 62.12,22.17 65.92,22.17 ; 65.91,19.56 65.79,19.43 65.79,17.91 68.29,15.41 U5.1 ; C7.1 65.92,22.16 R39.2
$1N353: length 4.6
  Top Layer w0.254: 25.37,22.99 25.37,25.37 25.78,25.78 27.36,25.78 U1.9
$1N378: length 9.9
  Top Layer w0.254: U1.10 26.81,25.29 26.29,24.77 26.29,24.13 26.42,24 32.64,24 33.03,23.61 R3.1
$1N388: length 3.5
  Top Layer w0.254: 32.34,25.3 34.52,25.3 R1.2
$1N1566: length 5
  Top Layer w0.254: R16.2 24.13,43.56 24.91,42.78 U6.1
$1N1568: length 5.1
  Top Layer w0.254: 22.13,41.27 24,41.27 25.01,42.28 U6.2
$1N1909: length 5
  Top Layer w0.254: 69.79,46.35 69.82,46.32 70.9,46.32 71.69,47.11 71.69,49.82
$1N1914: length 9.4
  Top Layer w0.254: 62.55,50.27 64.68,48.13 69.72,48.13 69.79,48.07 69.79,46.85
$1N1921: length 4.2
  Top Layer w0.254: 61.25,47.62 62.03,46.85 U7.1
$1N2264: length 4.9
  Top Layer w0.254: U8.9 59.27,26.93 59.1,26.76 59.1,24.79 59.69,24.2
$1N2269: length 9.4
  Top Layer w0.254: U8.10 61.15,25.84 61.59,25.4 68.58,25.4 68.9,25.08 68.9,24.37
$1N2276: length 4.8
  Top Layer w0.254: U8.1 68.93,26.43 70.62,25.98
$1N4532: length 6.3
  Top Layer w0.254: U6.9 31.57,42.29 32.73,42.29 33.27,42.93 R19.1
$1N4545: length 7.8
  Top Layer w0.254: R18.1 27.68,46 29.49,44.96 31.37,44.96 31.56,44.77 U6.10

## Copper pours and planes (outline as drawn; the poured copper is in the pictures)
GND on Inner1: 0,74.55 73.15,74.55 73.15,0 0,0

# Board PCB2
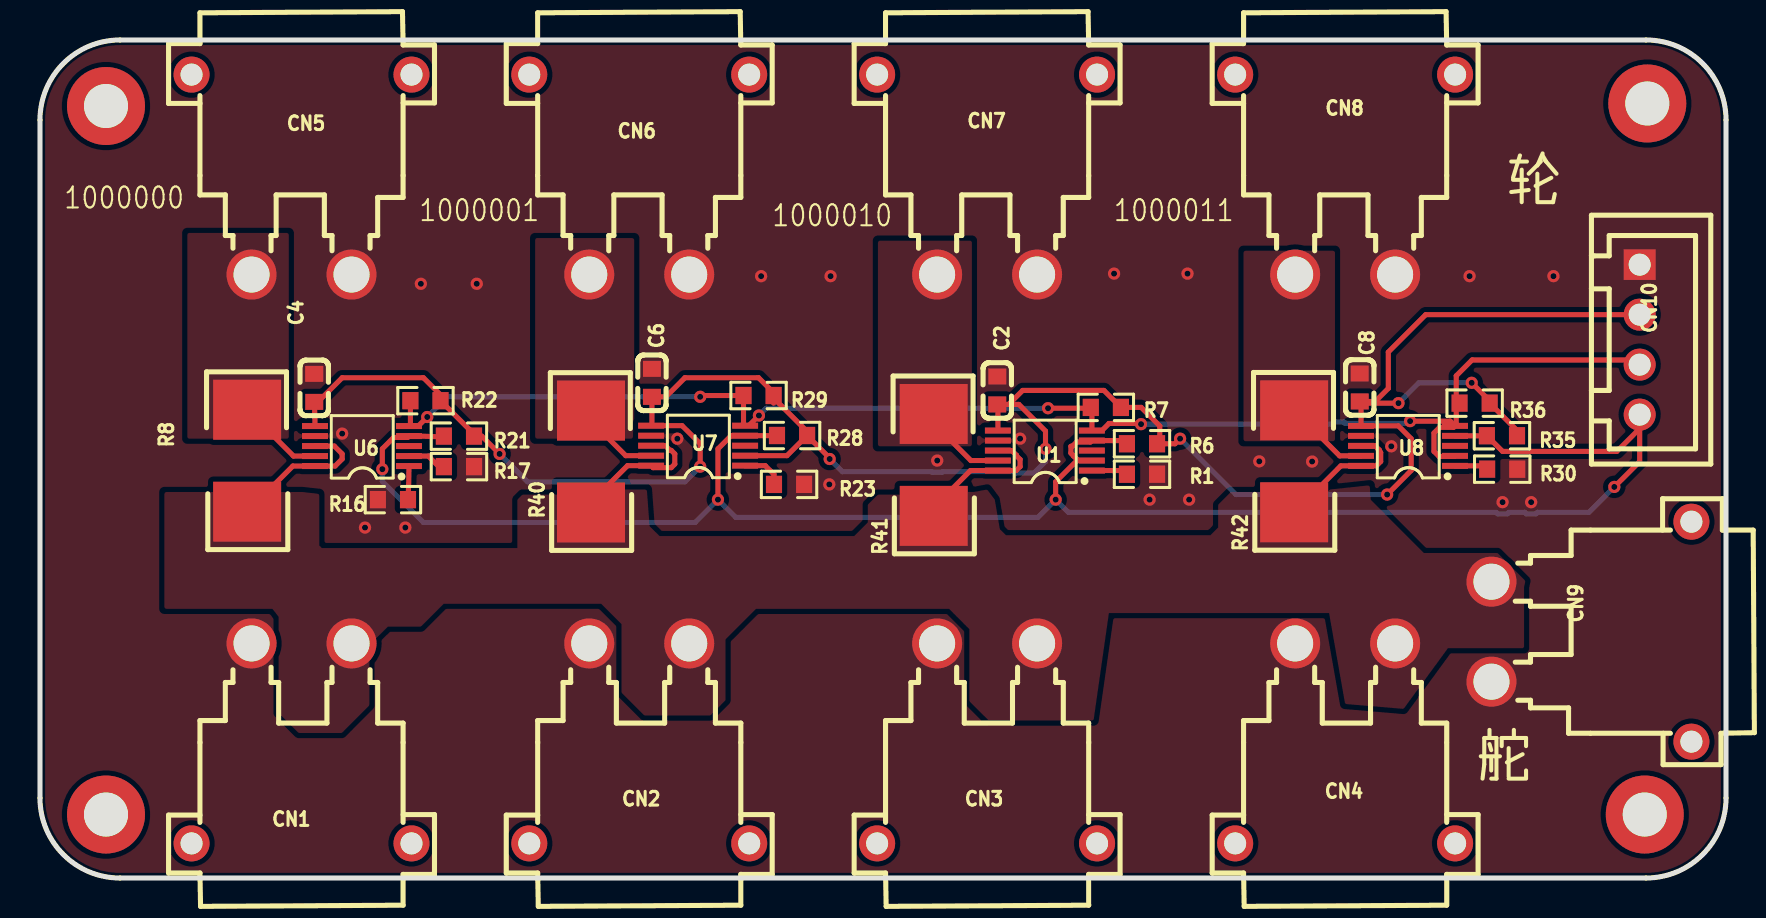
[diagram p4: board, top side]
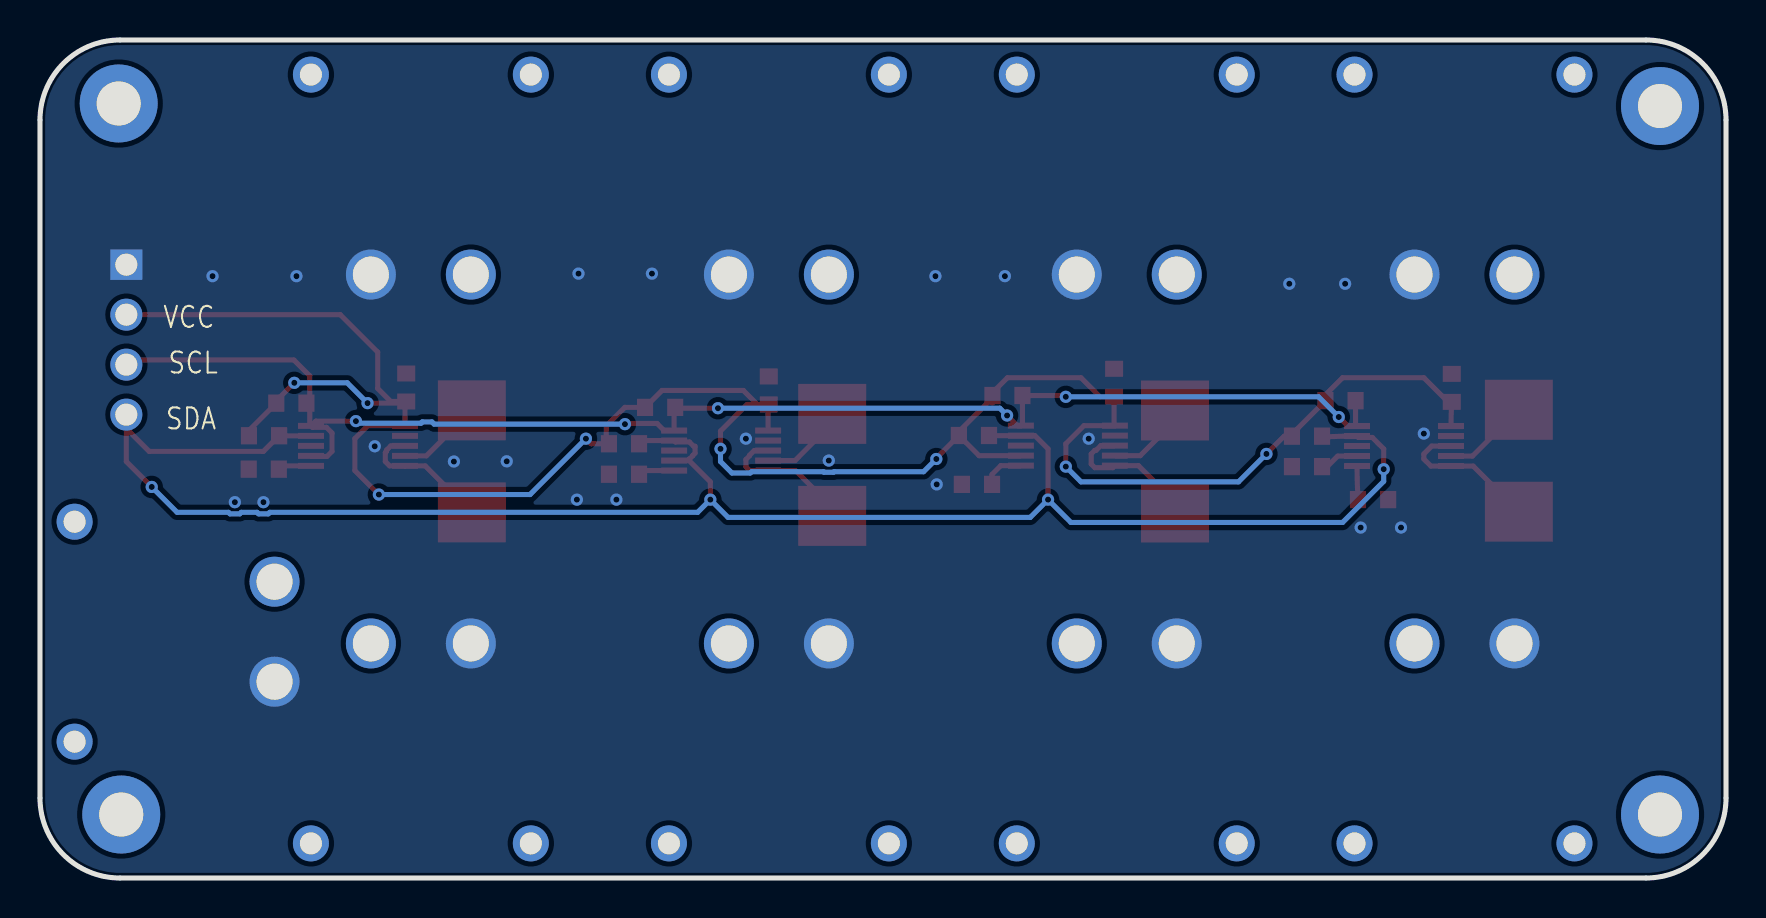
[diagram p5: board, bottom side, seen from below]

Outline 84.33 x 41.91 mm; copper layers: Top Layer, Bottom Layer. Coordinates in mm from the lower left corner of the outline.
Outline path: 0,37.91 0,4 arc(1.17,1.17) 4,0 80.33,0 arc(83.16,1.17) 84.33,4 84.33,37.91 arc(83.16,40.74) 80.33,41.91 4,41.91 arc(1.17,40.74) 0,37.91
Stack: Top Layer 0.035mm / Dielectric1 1.51mm FR4 er 4.5 / Bottom Layer 0.035mm

## Design rules (mm)
template: 自定义配置
spacing copperThickness1oz (default): track to track 0.102, other pairs 0.152 to 0.3
spacing copperThickness2oz: track to track 0.203, other pairs 0.152 to 0.3
track width copperThickness1oz (default): min 0.127, default 0.254, max 2.54
track width copperThickness2oz: min 0.203, default 0.254, max 2.54
differential pair differentialPair (default): width min 0.127, default 0.254, max 2.54; gap min 0.152, default 0.152
via viaSize (default): diameter min 0.5, default 0.61, max 10; hole min 0.3, default 0.305, max 6.3

## Placement (name value [footprint] x y rotation side)
C2  0.1uf  [C0603]  47.88 24.38 90 top
C4  0.1uf  [C0603]  13.72 24.51 90 top
C6  0.1uf  [C0603]  30.61 24.76 90 top
C8  0.1uf  [C0603]  66.01 24.53 90 top
CN1  XT30PW-M30.G.Y  [CONN-TH_XT30PW-M]  13.08 6.73 0 top
CN2  XT30PW-M30.G.Y  [CONN-TH_XT30PW-M]  29.97 6.73 0 top
CN3  XT30PW-M30.G.Y  [CONN-TH_XT30PW-M]  47.37 6.73 0 top
CN4  XT30PW-M30.G.Y  [CONN-TH_XT30PW-M]  65.28 6.73 0 top
CN5  XT30PW-M30.G.Y  [CONN-TH_XT30PW-M]  13.08 35.18 180 top
CN6  XT30PW-M30.G.Y  [CONN-TH_XT30PW-M]  29.97 35.18 180 top
CN7  XT30PW-M30.G.Y  [CONN-TH_XT30PW-M]  47.37 35.18 180 top
CN8  XT30PW-M30.G.Y  [CONN-TH_XT30PW-M]  65.28 35.18 180 top
CN9  XT30PW-M30.G.Y  [CONN-TH_XT30PW-M]  77.6 12.32 90 top
CN10  ZX-XH2.54-4PZZ  [CONN-TH_4P-P2.50_4PIN]  80.01 26.92 270 top
NOREF  -  [Pad_e67]  3.3 38.61 0 top
NOREF#2  -  [Pad_e69]  3.3 3.17 0 top
NOREF#3  -  [Pad_e68]  80.39 38.73 0 top
NOREF#4  -  [Pad_e70]  80.26 3.17 0 top
R1  10K  [R0603]  55.12 20.19 180 top
R6  10K  [R0603]  55.12 21.72 180 top
R7  10K  [R0603]  53.31 23.54 0 top
R8  2mΩ  [RES-SMD_L6.4-W3.2-A]  10.36 20.87 90 top
R16  10K  [R0603]  17.65 18.92 0 top
R17  10K  [R0603]  20.95 20.57 180 top
R21  10K  [R0603]  20.95 22.1 180 top
R22  10K  [R0603]  19.28 23.87 0 top
R23  10K  [R0603]  37.47 19.68 180 top
R28  10K  [R0603]  37.62 22.13 180 top
R29  10K  [R0603]  35.94 24.13 0 top
R30  10K  [R0603]  73.13 20.45 180 top
R35  10K  [R0603]  73.12 22.12 180 top
R36  10K  [R0603]  71.76 23.75 0 top
R40  2mΩ  [RES-SMD_L6.4-W3.2-A]  27.56 20.83 90 top
R41  2mΩ  [RES-SMD_L6.4-W3.2-A]  44.7 20.66 90 top
R42  2mΩ  [RES-SMD_L6.4-W3.2-A]  62.73 20.84 90 top
U1  INA226AIDGST  [VSSOP-10_L3.0-W3.0-P0.50-LS4.9-BL]  50.26 21.38 90 top
U6  INA226AIDGST  [VSSOP-10_L3.0-W3.0-P0.50-LS4.9-BL]  16.11 21.6 90 top
U7  INA226AIDGST  [VSSOP-10_L3.0-W3.0-P0.50-LS4.9-BL]  32.92 21.62 90 top
U8  INA226AIDGST  [VSSOP-10_L3.0-W3.0-P0.50-LS4.9-BL]  68.42 21.61 90 top

## Footprints (pads in the part's own frame, mm; a bottom-side part is the same pattern mirrored in y, then rotated)
C0603
  rect 0.8x0.9 smd: 1(-0.7,0) 2(0.7,0)
CONN-TH_4P-P2.50_4PIN
  rect 1.524x1.6 hole 1.1: 1(-3.75,0)
  round 1.6 hole 1.1: 2(-1.25,0) 3(1.25,0) 4(3.75,0)
CONN-TH_XT30PW-M
  round 2.5 hole 1.8: 1(-2.5,5) 2(2.5,5)
  round 1.8 hole 1.1: 3(5.5,-5) 4(-5.5,-5)
Pad_e67
  round 3.9 hole 2.2: 1(0,0)
Pad_e68
  round 3.9 hole 2.2: 2(0,0)
Pad_e69
  round 3.9 hole 2.2: 3(0,0)
Pad_e70
  round 3.9 hole 2.2: 4(0,0)
R0603
  rect 0.806x0.864 smd: 1(-0.753,0) 2(0.753,0)
RES-SMD_L6.4-W3.2-A
  rect 3x3.4 smd: 1(-2.55,0) 2(2.55,0)
VSSOP-10_L3.0-W3.0-P0.50-LS4.9-BL
  rect 0.3x1.3 smd: 1(-1,-2.35) 2(-0.5,-2.35) 3(0,-2.35) 4(0.5,-2.35) 5(1,-2.35) 6(1,2.35) 7(0.5,2.35) 8(0,2.35) 9(-0.5,2.35) 10(-1,2.35)

## Nets
As in the schematic.

Pads without a net: CN1 3 4; CN2 3 4; CN3 3 4; CN4 3 4; CN5 3 4; CN6 3 4; CN7 3 4; CN8 3 4; CN9 3 4; NOREF 1; NOREF#2 3; NOREF#3 2; NOREF#4 4; U1 3; U6 3; U7 3; U8 3

## Via types
v1: diameter 0.61, hole 0.305, Top Layer to Bottom Layer, 40 vias

## Routing (per net, layer and track width the routed paths; a pad name or vN(x,y) marks a point on that pad's centre or on a via; arc(x,y) is an arc through that point)
GND:
  vias: v1(15.11,22.22) v1(16.26,17.53) v1(18.27,17.53) v1(19.05,29.72) v1(21.84,29.72) v1(31.88,21.97) v1(36.07,30.1) v1(39.48,19.68) v1(39.54,30.1) v1(44.88,20.88) v1(49.02,21.97) v1(53.72,30.23) v1(55.5,18.92) v1(57.39,30.23) v1(57.48,18.92) v1(60.98,20.84) v1(63.63,20.83) v1(67.59,21.59) v1(71.5,30.1) v1(73.15,18.8) v1(74.58,18.8) v1(75.7,30.1)
VCC: length 117.2
  Top Layer w0.254: 48.45,23.68 C2.1 47.91,23.65 U1.6 ; 48.45,23.68 48.96,23.68 50.29,22.35 v1(50.29,21.46) ; 48.45,23.68 49.15,24.38 53.21,24.38 ; v1(22.99,21.21) 22.1,22.1 R21.1 ; 21.46,22.07 21.46,22.45 R22.2 20.03,24.16 19.18,25.02 15.11,25.02 13.91,23.81 C4.1 arc(13.75,23.21) U6.6 ; 66.07,23.77 C8.1 66.79,23.83 67.44,24.48 67.44,26.3 69.31,28.17 CN10.2 ; 66.07,23.77 66.09,23.75 v1(67.95,23.75) ; 66.07,23.77 U8.6 67.94,22.61 68.58,21.97 68.58,20.38 v1(67.38,19.18) ; v1(39.5,20.95) 39.5,21 R28.1 ; 36.69,23.75 36.69,23.88 36.64,23.94 ; v1(57.02,21.97) 56.77,21.72 R6.1 ; 55.74,21.72 56.01,21.98 56.01,22.61 55.08,23.54 R7.2 53.22,24.38 ; R28.1 37.36,21.12 U7.2 ; R28.1 38.37,22.33 36.69,24 36.69,24.27 35.94,25.02 32.26,25.02 31.3,24.06 C6.1 30.61,22.66 U7.6 32.11,22.62 33.02,21.72 v1(33.02,20.57) ; R36.2 73.88,22.38 R35.1 ; v1(71.61,24.76) 72.51,23.86
  Bottom Layer w0.254: v1(67.95,23.75) 68.96,24.76 v1(71.61,24.76) ; v1(67.38,19.18) 59.82,19.18 v1(57.02,21.97) ; v1(50.29,21.46) 50.29,20.83 49.72,20.26 48.8,20.26 48.74,20.32 45.14,20.32 45.12,20.29 44.63,20.29 44.61,20.32 40.13,20.32 v1(39.5,20.95) ; v1(22.99,21.21) 24.38,19.81 32.26,19.81 v1(33.02,20.57)
A1-: length 4.4
  Top Layer w0.254: R8.2 12.68,21.1 U6.9
A2-: length 4.2
  Top Layer w0.254: R40.2 27.56,22.86 29.3,21.12 U7.9
A3-: length 4.5
  Top Layer w0.254: U1.9 46.56,20.88 44.7,22.74 R41.2
A4-: length 4.3
  Top Layer w0.254: U8.9 65.01,21.11 R42.2
A+: length 29.3
  Top Layer w0.254: R8.1 12.65,20.6 U6.10 14.76,20.6 15.11,20.95 15.11,21.21 14.72,21.6 U6.8 ; R41.1 44.7,18.54 46.54,20.38 U1.10 48.83,20.38 49.02,20.57 49.02,20.93 48.84,21.11 48.84,21.14 48.61,21.38 U1.8 ; R42.1 62.74,18.29 65.06,20.61 U8.10 66.84,20.61 67.06,20.83 67.06,21.27 67,21.33 67,21.38 66.98,21.4 66.98,21.41 66.78,21.61 U8.8 ; 30.57,21.62 31.27,21.62 31.51,21.39 31.57,21.39 31.75,21.21 31.75,20.7 31.57,20.52 30.67,20.52 U7.10 29.39,20.62 27.56,18.8 R40.1
SCL: length 72.3
  Top Layer w0.254: U8.5 70.84,22.67 70.84,25.12 71.63,25.91 79.78,25.91 CN10.3 ; U8.5 70.7,22.54 70.01,22.54 69.72,22.26 69.72,21.34 69.98,21.08 70.74,21.08 U8.2 ; U8.5 70.53,22.85 v1(68.53,22.85) ; v1(50.42,23.49) 52.52,23.49 R7.1 52.61,23.48 U1.5 53.11,22.38 53.47,22.73 55.04,22.73 v1(55.07,22.7) ; 35.19,23.75 35.19,22.7 35.27,22.62 35.45,22.62 v1(35.96,23.13) ; v1(19.37,23.05) 18.92,22.6 U6.5 18.53,22.67 18.53,23.62 ; 35.19,24 35.06,24.13 33.15,24.13
  Bottom Layer w0.254: v1(68.53,22.85) 68.42,22.74 65.27,22.74 65.21,22.81 64.72,22.81 64.61,22.7 v1(55.07,22.7) ; v1(50.42,23.49) 36.32,23.49 v1(35.96,23.13) ; v1(19.37,23.05) 20.38,24.06 v1(33.02,24.06)
SDA: length 96
  Top Layer w0.254: 51.94,20.88 51.86,20.88 50.8,19.81 v1(50.8,18.92) ; 51.94,20.88 U1.2 ; 51.94,20.88 51.86,20.95 51.85,20.95 51.68,21.11 51.68,21.13 51.56,21.25 51.56,21.59 51.63,21.59 51.85,21.81 52.54,21.81 U1.4 54.08,21.88 54.24,21.72 ; 80.01,22.48 78.87,21.34 73.15,21.34 R35.2 72.36,22.11 U8.4 ; 80.01,22.48 CN10.4 ; 80.01,22.48 80.01,20.83 78.87,19.68 ; v1(33.91,18.92) 33.91,21.46 34.57,22.12 U7.4 36.85,22.12 R28.2 ; v1(17.12,20.45) 17.12,21.46 17.69,22.03 18.38,22.03 U6.4 arc(19.2,22.09) 19.95,22.07
  Bottom Layer w0.254: v1(78.74,19.56) 77.47,18.29 74.9,18.29 74.82,18.21 74.34,18.21 74.26,18.29 73.47,18.29 73.39,18.21 72.91,18.21 72.83,18.29 51.44,18.29 v1(50.8,18.92) 49.91,18.03 34.8,18.03 v1(33.91,18.92) 32.76,17.78 19.18,17.78 17.12,19.84 v1(17.12,20.45)
$1N1720: length 1.5
  Top Layer w0.254: U1.1 54.05,20.38 54.11,20.32
$1N1742: length 1.7
  Top Layer w0.254: U6.1 arc(18.44,19.76) R16.2
$1N1743: length 2
  Top Layer w0.254: R17.2 19.95,20.57 19.42,21.1 U6.2
$1N1761: length 2.1
  Top Layer w0.254: R23.2 36.71,20.18 36.27,20.62 35.27,20.62
$1N1774: length 1.7
  Top Layer w0.254: R30.2 72.22,20.61 U8.1

## Copper pours and planes (outline as drawn; the poured copper is in the pictures)
GND on Top Layer: -6.6,49.66 97.03,49.66 97.03,-12.95 -6.6,-12.95
GND on Bottom Layer: -9.91,55.12 104.14,55.12 104.14,-18.03 -9.91,-18.03
A1- on Top Layer: 7.37,32.26 12.45,32.26 12.45,21.97 7.37,21.97
A2- on Top Layer: 24.77,32 29.72,32 29.72,21.97 24.77,21.97
A3- on Top Layer: 41.91,31.88 46.61,31.88 46.61,21.59 41.91,21.59
A4- on Top Layer: 60.2,31.37 64.77,31.37 64.77,21.84 60.2,21.84
A+ on Top Layer: 13.13,19.3 13.97,19.21 13.97,16.63 14.1,16.5 23.87,16.5 23.88,16.51 23.88,18.92 24.13,19.18 28.58,19.18 28.83,19.43 30.35,19.43 30.49,17.6 30.99,17.1 40.72,17.1 41.4,17.78 41.4,18.67 41.91,19.18 45.47,19.18 45.59,19.05 45.85,19.31 46.71,19.31 47.37,19.43 47.75,18.92 48.01,17.45 48.31,17.14 58.55,17.14 58.93,17.53 58.93,18.67 59.56,19.3 64.39,19.3 64.52,19.43 66.5,19.64 66.56,18.91 69.22,16.26 72.9,16.26 74.3,14.86 74.23,14.54 74.23,11.49 70.42,11.49 68.2,8.46 65.28,8.7 64.47,13.25 53.47,13.25 52.7,7.87 47.45,7.87 46.48,8.84 46.48,12.45 45.47,13.46 35.81,13.46 34.29,11.94 34.29,8.89 33.53,8.13 30.23,8.13 29.08,9.28 29.08,12.7 28.07,13.72 20.19,13.72 19.05,12.57 17.4,12.57 16.48,11.65 16.48,8.64 15.09,7.25 12.94,7.25 11.94,8.25 11.94,13.06 11.62,13.46 6.22,13.46 6.22,19.3

## Text on the board
Bottom Silkscreen Layer: SCL | SDA | VCC
Top Silkscreen Layer: 1000000 | 1000001 | 1000010 | 1000011 | 舵 | 轮
